# Altium schematic sheet usb HUB.SchDoc
size A4
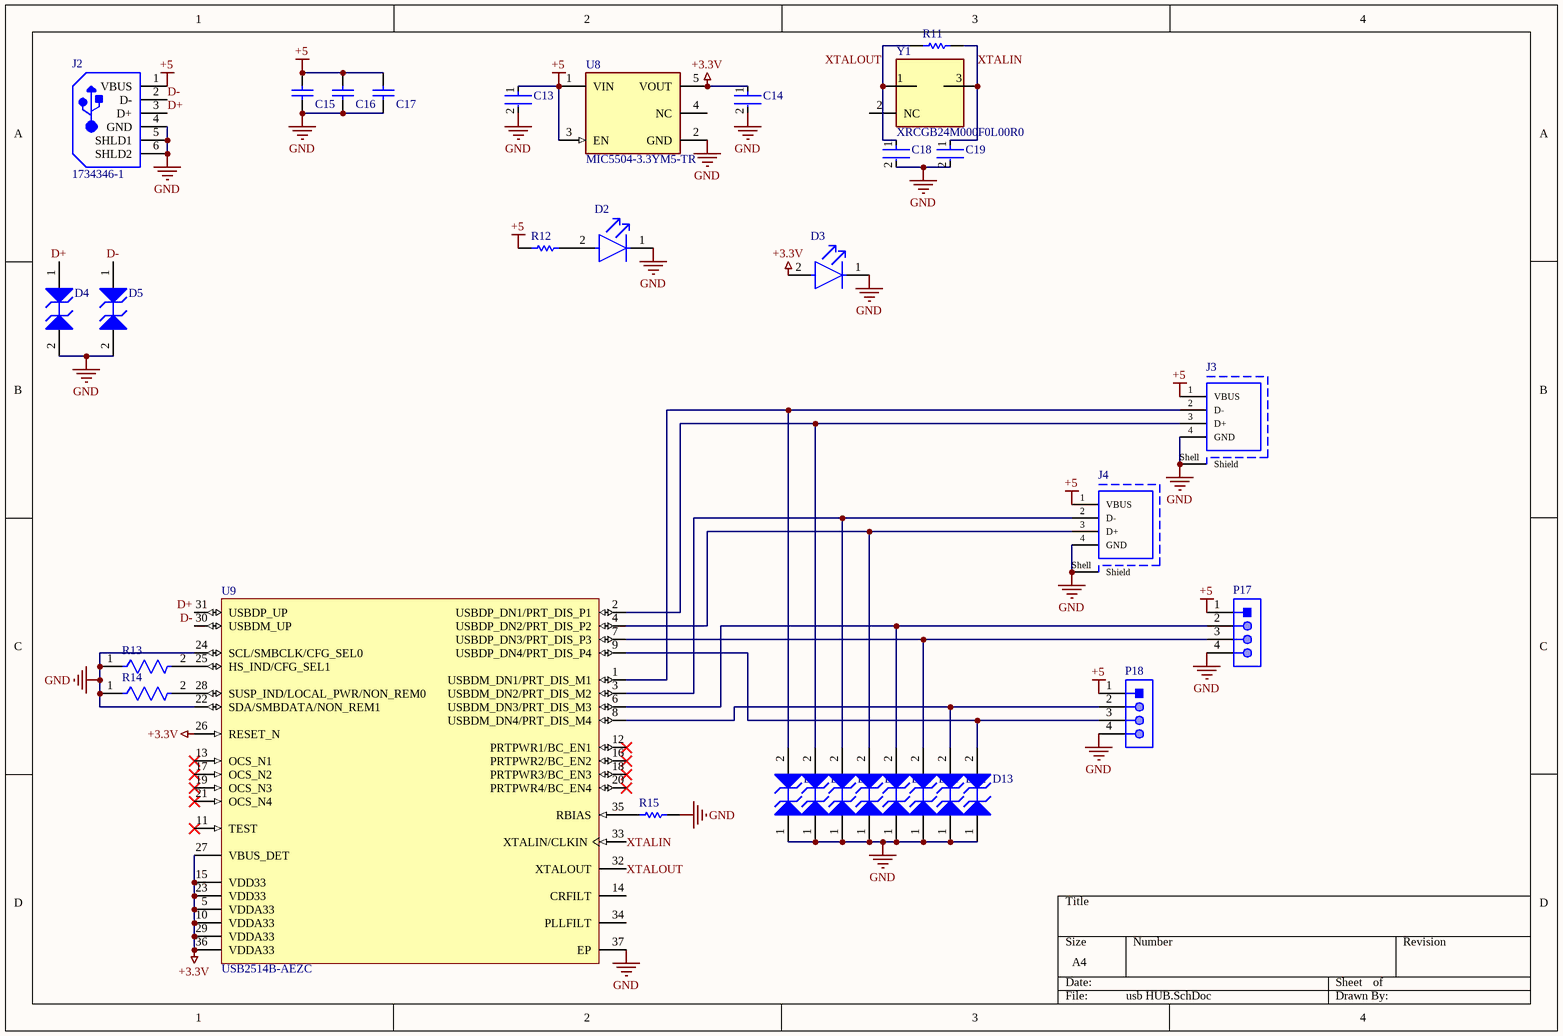
[diagram p0: usb HUB.SchDoc]

## Parts
C13  CL31B105MAHNNNE  [FP-CL31-IPC_B]  (value not drawn)
C14  CL31B105MAHNNNE  [FP-CL31-IPC_B]  (value not drawn)
C15  12061Z475KAT2A  [CAPC3216X190X50ML20T25]  (value not drawn)
C16  12061Z475KAT2A  [CAPC3216X190X50ML20T25]  (value not drawn)
C17  12061Z475KAT2A  [CAPC3216X190X50ML20T25]  (value not drawn)
C18  GRM31A7U2J180JW31D  [FP-GRM31A-0_2-e0_3_0_95-IPC_B]  (value not drawn)
C19  GRM31A7U2J180JW31D  [FP-GRM31A-0_2-e0_3_0_95-IPC_B]  (value not drawn)
D2  APTD3216CGCK  [FP-APTD3216CGCK-MFG]  (value not drawn)
D3  APTD3216CGCK  [FP-APTD3216CGCK-MFG]  (value not drawn)
D4  ESD9B3.3ST5G  [ONSC-SOD-923-2-514AB-01_V]  (value not drawn)
D5  ESD9B3.3ST5G  [ONSC-SOD-923-2-514AB-01_V]  (value not drawn)
D6  ESD9B3.3ST5G  [ONSC-SOD-923-2-514AB-01_V]  (value not drawn)
D7  ESD9B3.3ST5G  [ONSC-SOD-923-2-514AB-01_V]  (value not drawn)
D8  ESD9B3.3ST5G  [ONSC-SOD-923-2-514AB-01_V]  (value not drawn)
D9  ESD9B3.3ST5G  [ONSC-SOD-923-2-514AB-01_V]  (value not drawn)
D10  ESD9B3.3ST5G  [ONSC-SOD-923-2-514AB-01_V]  (value not drawn)
D11  ESD9B3.3ST5G  [ONSC-SOD-923-2-514AB-01_V]  (value not drawn)
D12  ESD9B3.3ST5G  [ONSC-SOD-923-2-514AB-01_V]  (value not drawn)
D13  ESD9B3.3ST5G  [ONSC-SOD-923-2-514AB-01_V]  (value not drawn)
J2  1734346-1  [TECO-1734346-1_V]
J3  629104190121  [629104190121]  (value not drawn)
J4  629104190121  [629104190121]  (value not drawn)
P17  61300411121  [61300411121]  (value not drawn)
P18  61300411121  [61300411121]  (value not drawn)
R11  ERJ-8ENF1004V  [RESC3216X70X50NL05T20]  (value not drawn)
R12  ERJ8ENF2203V  [RESC3216X70X50LL05T20]  (value not drawn)
R13  CRCW120656K0FKEA  [FP-CRCW1206-e3-IPC_C]  (value not drawn)
R14  CRCW120656K0FKEA  [FP-CRCW1206-e3-IPC_C]  (value not drawn)
R15  ERJ-8GEYJ123V  [RESC3216X70X50NL05T20]  (value not drawn)
U8  MIC5504-3.3YM5-TR  [FP-SOT23-5LD-PL-1-MFG]
U9  USB2514B-AEZC  [MCHP-QFN-36_V]
Y1  Part Number: XRCGB24M000F0L00R0  [Murata_XRCGB24M000F0L00R0_0]  (hidden comment: Crys_Murata_XRCGB24M000F0L00R0_eec)

## Nets
+3.3V: C14.1 D3.2(A) U8.5(VOUT) U9.5(VDDA33) U9.10(VDDA33) U9.15(VDD33) U9.23(VDD33) U9.26(RESET_N) U9.27(VBUS_DET) U9.29(VDDA33) U9.36(VDDA33)
+5: C13.1 C15.1 C16.1 C17.1 J2.1(VBUS) J3.1(VBUS) J4.1(VBUS) P17.1 P18.1 R12.1 U8.1(VIN) U8.3(EN)
GND: C13.2 C14.2 C15.2 C16.2 C17.2 C18.2 C19.2 D2.1(C) D3.1(C) D4.2(A2) D5.2(A2) D6.1(A1) D7.1(A1) D8.1(A1) D9.1(A1) D10.1(A1) D11.1(A1) D12.1(A1) D13.1(A1) J2.4(GND) J2.5(SHLD1) J2.6(SHLD2) J3.4(GND) J3.Shell(Shield) J4.4(GND) J4.Shell(Shield) P17.4 P18.4 R13.1 R14.1 R15.2 U8.2(GND) U9.22(SDA/SMBDATA/NON_REM1) U9.24(SCL/SMBCLK/CFG_SEL0) U9.37(EP)
D+: D4.1(A1) J2.3(D+) U9.31(USBDP_UP)
D-: D5.1(A1) J2.2(D-) U9.30(USBDM_UP)
XTALIN: C19.1 R11.2 U9.33(XTALIN/CLKIN) Y1.3(2_Crystal_Terminal)
XTALOUT: C18.1 R11.1 U9.32(XTALOUT) Y1.1(1_Crystal_Terminal)
NetD2_2: D2.2(A) R12.2
NetD6_2: D6.2(A2) J3.2(D-) U9.1(USBDM_DN1/PRT_DIS_M1)
NetD7_2: D7.2(A2) J3.3(D+) U9.2(USBDP_DN1/PRT_DIS_P1)
NetD8_2: D8.2(A2) J4.2(D-) U9.3(USBDM_DN2/PRT_DIS_M2)
NetD9_2: D9.2(A2) J4.3(D+) U9.4(USBDP_DN2/PRT_DIS_P2)
NetD10_2: D10.2(A2) P17.2 U9.6(USBDM_DN3/PRT_DIS_M3)
NetD11_2: D11.2(A2) P17.3 U9.7(USBDP_DN3/PRT_DIS_P3)
NetD12_2: D12.2(A2) P18.2 U9.8(USBDM_DN4/PRT_DIS_M4)
NetD13_2: D13.2(A2) P18.3 U9.9(USBDP_DN4/PRT_DIS_P4)
NetR13_2: R13.2 U9.25(HS_IND/CFG_SEL1)
NetR14_2: R14.2 U9.28(SUSP_IND/LOCAL_PWR/NON_REM0)
NetR15_1: R15.1 U9.35(RBIAS)

Not connected (* = marked no-connect by the designer): U8 4(NC); U9 11(TEST)* 12(PRTPWR1/BC_EN1)* 13(OCS_N1)* 14(CRFILT) 16(PRTPWR2/BC_EN2)* 17(OCS_N2)* 18(PRTPWR3/BC_EN3)* 19(OCS_N3)* 20(PRTPWR4/BC_EN4)* 21(OCS_N4)* 34(PLLFILT); Y1 2(NC)

## Library data of the parts
C13 C14 = CMP-13271-000122-1: Cap Ceramic 1uF 25V X7R ±20% SMD 1206 +125°C Embossed T/R; Radiation Hardening: No; Height: 1.6mm; Mount: Surface Mount; Packaging: Tape and Reel; Width: 0.063inch; Contact Plating: Tin; Package Quantity: 1; Thickness: 0.071inch; Tolerance: 20%; Case/Package: 1206; Length: 3.2mm; Case Code (Imperial): 1206; Dielectric: X7R; Voltage Rating: 25V; Depth: 1.6mm; Voltage Rating (DC): 25V; Max Operating Temperature: 125°C; Case Code (Metric): 3216; Min Operating Temperature: -55°C; Lead Free: Lead Free; Capacitance: 1uF
C15-C17 = CMP-2000-05019-1: Chip Capacitor, 4.7 uF, +/- 10%, 100 V, -55 to 125 degC, 1206 (3216 Metric), RoHS, Tape and Reel; Manufacturer: AVX; Dielectric Characteristic: X7S; Voltage Rating: 100V; SVHC: NoSVHC(17-Dec-2015); Ceramic Capacitor Case: 1206[3216Metric]; Capacitance: 4.7µF; Packaging: CutTape; Datasheet Version: Oct-13; Operating Temperature Max: 125degC; Manufacturer URL: http://www.avx.com/; MSL: MSL1-Unlimited; Datasheet URL: https://datasheet.ciiva.com/22677/1789384-22677168.pdf; Capacitance Tolerance: ±10%; Operating Temperature Min: -55degC
C18 C19 = CMP-06035-014678-1: Chip Multilayer Ceramic Capacitors for General Purpose, 1206, 18pF, U2J, -750ppm/°C, 5%, 630V; Case Code (Metric): 3216; Termination: SMD/SMT; Case Code (Imperial): 1206; Lead Free: Lead Free; Package Quantity: 4000; Voltage Rating: 630V; Case/Package: 1206; Radiation Hardening: No; Capacitance: 18pF; REACH SVHC: No SVHC; Thickness: 0.039inch; Min Operating Temperature: -55°C; Mount: Surface Mount; Depth: 1.6mm; Dielectric: U2J; Packaging: Tape and Reel; Max Operating Temperature: 125°C; Length: 3.2mm; Width: 0.063inch; Tolerance: 5%; Voltage Rating (DC): 630V; Height: 1mm
D2 D3 = CMP-2000-05792-2: LED GREEN CLEAR 2SMD; Forward Voltage: 2.1V; Forward Current: 20mA; Luminous Intensity: 300mcd; Number of LEDs: 1; Dominant Wavelength: 570nm; Viewing Angle: 50°; Lead Free: Lead Free; Lens Color: Clear; Mount: Surface Mount; Package Quantity: 2000; Height: 1.8mm; Number of Pins: 2; Test Current: 20mA; Case Code (Metric): 3216; Case/Package: 1206; Case Code (Imperial): 1206; Illumination Color: Green; Color: Green; Width: 1.6mm; Packaging: Tape and Reel; Min Operating Temperature: -40°C; Lens Style: Clear; Max Operating Temperature: 85°C; Length: 3.2mm
D4-D13 = CMP-1063-00120-1: Transient Voltage Suppressor, Micro-Packaged Diode for ESD Protection, 2-Pin SOD-923, Pb-Free, Tape and Reel; Manufacturer: On Semiconductor; Number of Lines: 1; V(BR) Min (V): 5; VRWM Max (V): 3.3; Direction: Bidirectional; ComponentLink3URL: http://www.onsemi.com/pub_link/Collateral/514AB.PDF; PartNumber: ESD9B3.3ST5G; PackageVersion: Rev. C, 03/2011; Mounting Technology: Surface Mount; PackageReference: SOD-923-2-514AB-01; RoHS: Pb-Free; DatasheetVersion: Rev. 2; ComponentLink1URL: http://www.onsemi.com/; PackageDescription: 2-Pin SOD, Body 0.8 x 0.6 mm; ComponentLink3Description: Package Specification; ComponentLink2URL: http://www.onsemi.cn/pub_link/Collateral/ESD9B-D.PDF; IR Max (uA): 1; Packing: Tape and Reel; ComponentLink2Description: Datasheet; ComponentLink1Description: Manufacturer URL
J2 = CMP-2000-07498-1: USB-B Receptacle Connector, Height 10.87 mm, 0 to 50 degC, RoHS, Tray; Manufacturer: TE Connectivity; Insulation Resistance: 1GR; Number of Contacts: 4; Number of Ports: 1; Plating: Nickel; Case\/Package: SMD/SMT; Insulation Material: Thermoplastic; Gender: Receptacle; Depth: 16mm; Contact Material: Bronze; Length: 16.5mm; ELV: Compliant; Packaging: Tray; RoHSCompliant: true; Number of Terminals: 4; Manufacturer URL: http://www.te.com/; Datasheet Version: Rev. C, 06/2011; Package Reference: 1734346-1; Flammability Rating: UL94V-0; Package Description: 4-Pin Pin Surface Mount Device, Body 12.04 x 16 mm, Height 10.87 mm; Mount: Horizontal; Mounting Technology: SurfaceMount; REACH SVHC: Unknown; Material: Bronze; Housing Colour: Black; Contact Plating: Gold; Package Quantity: 100; Orientation: RightAngle; Termination: SMD/SMT; Housing Material: Nylon; Number of Positions: 4; Datasheet URL: http://www.te.com/commerce/DocumentDelivery/DDEController?Action=srchrtrv&DocNm=1734346&DocType=Customer+Drawing&DocLang=English; Connector Type: Receptacle
J3 J4 = CMP-1502-03232-1: USB 2.0 Type A Receptacle WR-COM, Horizontal, SMT, Short Type with Pads and Pegs; Manufacturer: Wurth Elektronik; Contact Resistance: 30mOhm; Rated Current: 1.5A; Working Voltage: 30VAC; Orientation: Horizontal; Package Reference: 629104190121; Connector Type: USB2.0TypeA; Operating Temperature: -40to85degC; Publisher: WurthElektronik; Manufacturer URL: http://www.we-online.de; Mounting Technology: SMT; Packaging: TapeandReel; Datasheet URL: https://katalog.we-online.de/em/datasheet/629104190121.pdf; Part Number: 629104190121; Gender: Receptacle
P17 P18 = CMP-1502-01064-1: THT Vertical Pin Header WR-PHD, Pitch 2.54 mm, Single Row, 4 pins; Manufacturer: Wurth Elektronik; Withstanding Voltage: 500VAC; Rated Current: 3A; Working Voltage: 250VAC; Pin Number: 4; Gender: Male; Contact Resistance: 20mOhm; Pitch: 2.54mm; Manufacturer URL: http://www.we-online.de; Operating Temperature: -40to105degC; Packaging: Bag; Mounting Technology: THT; Package Reference: 61300411121; Datasheet URL: https://katalog.we-online.de/em/datasheet/6130xx11121.pdf; Publisher: WurthElektronik; Part Number: 61300411121; Row Number: Single; Orientation: Vertical
R11 = CMP-2003-00020-1: Manufacturer: Panasonic; Part Number: ERJ-8ENF1004V
R12 = CMP-2003-00820-1: Manufacturer: Panasonic; Part Number: ERJ8ENF2203V
R13 R14 = CMP-2003-02282-2: RES Thick Film, 56kΩ, 1%, 0.25W, 100ppm/°C, 1206; Voltage Rating (DC): 200V; Resistance: 56kR; Power Rating: 250mW; Packaging: Tape and Reel; Case/Package: 1206; Lead Free: Lead Free; Height: 0.55mm; Max Operating Temperature: 155°C; Case Code (Metric): 3216; Tolerance: 1%; Contact Plating: Tin; Min Operating Temperature: -55°C; Termination: SMD/SMT; Voltage Rating: 200V; Number of Pins: 2; Radiation Hardening: No; Military Standard: Not; Depth: 1.6mm; Composition: Thick Film; Number of Terminations: 2; Package Quantity: 10; Temperature Coefficient: 100ppm/°C; Width: 0.063inch; Case Code (Imperial): 1206; Weight: 0.000353oz; Length: 3.2mm; Max Power Dissipation: 250mW; Features: Automotive AEC-Q200
R15 = CMP-2003-00554-1: Manufacturer: Panasonic; Part Number: ERJ-8GEYJ123V
U8 = CMP-2000-07604-2: IC REG LINEAR 3.3V 300MA SOT23-5; Quiescent Current: 38uA; Operating Supply Current: 42uA; Max Input Voltage: 5.5V; Min Input Voltage: 2.5V; Output Type: Fixed; Power Supply Rejection Ratio (PSRR): 60dB; Dropout Voltage: 380mV; Accuracy: 3%; Number of Outputs: 1; Nominal Output Voltage: 3.3V; Max Output Current: 300mA; Length: 2.9mm; Mount: Surface Mount; Width: 1.6mm; Packaging: Tape and Reel; Output Current: 300mA; Min Operating Temperature: -40°C; Max Operating Temperature: 125°C; Height: 1.1mm; Case/Package: SOT-23-5; REACH SVHC: No SVHC; Number of Pins: 5; Output Voltage: 3.3V
U9 = CMP-2000-05217-1: USB 2.0 High-Speed Hub Controller, 4 Ports, 3 to 3.6 V, 0 to 85 degC, 36-Pin QFN, RoHS, Tray; Manufacturer: Microchip; Interface: I²CEEPROM,SMBus(2-Wire,I²C); Other Names: 638-1122; Voltage - Supply: 3V~3.6V; Current - Supply: 70mA; Manufacturer URL: http://www.microchip.com/; Packaging: Tray; Function: -; Standards: -; Category: IntegratedCircuits(ICs); Package / Case: 36-VFQFNExposedPad; Supplier Device Package: 36-QFN(6x6); Family: Interface-Controllers; Datasheet Version: DS00001692C, 10/2015; Standard Package: 490; Series: -; Protocol: -; Datasheet URL: http://ww1.microchip.com/downloads/en/DeviceDoc/00001692C.pdf; Operating Temperature: -; Manufacturer Part Number: USB2514B-AEZC
Y1 = Crys_Murata_XRCGB24M000F0L00R0_eec: CRYS 24MHz ±100ppm Crystal 6pF 150 Ohm -30°C ~ 85°C Surface Mount 4-SMD, No Lead; Manufacturer: Murata; Frequency Tolerance: ±100ppm max. (25±3℃); Frequency Shift by Temperature: ±50ppm max.; Drive Level(max.): 300μW; Equivalent Series Resistance(max.): 150Ω; Frequency: 24.0000MHz; helpURL: https://upverter.com/upn/revision/aff6462790ac0861/; ComponentLink2Description: Datasheet; Temperature: -30°C to +85°C; Package: SMT_2MM0_1MM6; Supplier 2: Mouser; Price: 0.196763354289; Supplier 1: Digi-Key; ComponentLink1URL: https://upverter.com/upn/revision/aff6462790ac0861/; Supplier Part Number 2: 81-XRCGB24M000F0L0R0; Supplier Part Number 1: 490-5575-1-ND; ComponentLink1Description: Upverter; ComponentLink2URL: http://www.murata.com/~/media/webrenewal/support/library/catalog/products/timingdevice/crystalu/p79e.ashx; RoHS: TRUE; Mouser Part Number: 81-XRCGB24M000F0L0R0; Temperature Range High: +85°C; Digikey Description: CRYS 24MHz ±100ppm Crystal 6pF 150 Ohm -30°C ~ 85°C Surface Mount 4-SMD, No Lead; Digikey Part Number: 490-5575-1-ND; Lead Free: yes; Frequency Aging: ±50ppm max.; Temperature Range Low: -30°C; Load Capacitance: 6pF